# EAGLE design ADS7828-TSSOP (EAGLE 8.1.1)
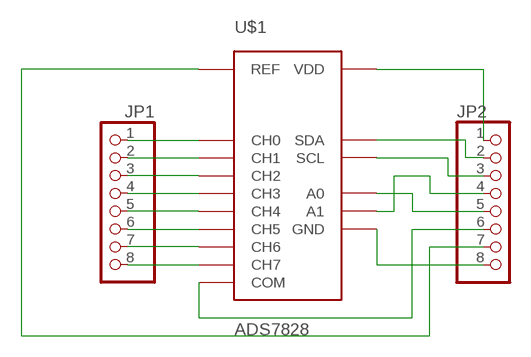
[diagram p0: schematic, sheet 1]

## Parts
JP1  PINHD-1X8  [1X08]
JP2  PINHD-1X8  [1X08]
U$1  ADS7828  [TSSOP16]

## Nets
N$1: JP1.1 U$1.1(CH0)
N$2: JP1.2 U$1.2(CH1)
N$3: JP1.3 U$1.3(CH2)
N$4: JP1.4 U$1.4(CH3)
N$5: JP1.5 U$1.5(CH4)
N$6: JP1.6 U$1.6(CH5)
N$7: JP1.7 U$1.7(CH6)
N$8: JP1.8 U$1.8(CH7)
N$9: JP2.8 U$1.9(GND)
N$10: JP2.7 U$1.10(REF)
N$11: JP2.6 U$1.11(COM)
N$12: JP2.5 U$1.12(A0)
N$13: JP2.4 U$1.13(A1)
N$14: JP2.3 U$1.14(SCL)
N$15: JP2.2 U$1.15(SDA)
N$16: JP2.1 U$1.16(VDD)

## Library data of the parts
JP1 JP2 = pinhead:PINHD-1X8: PIN HEADER
U$1 = texas:ADS7828: Texas Instruments ADS7828 8-channel 12-bit I2C ADC Datasheet <http://www.ti.com/lit/ds/symlink/ads7828.pdf>

## Board
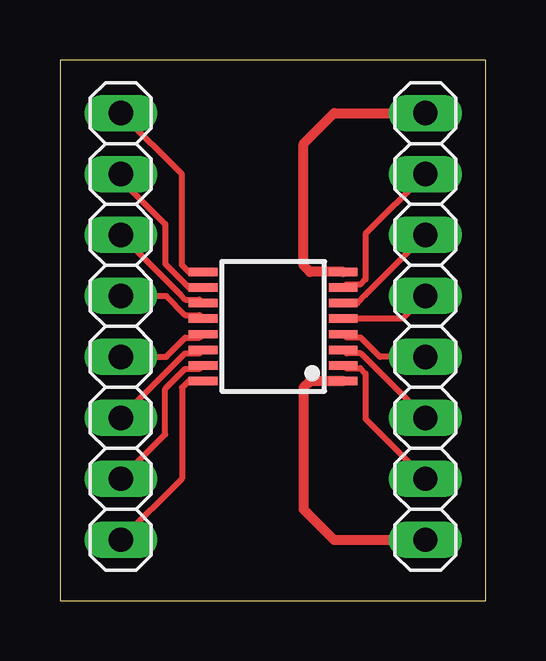
[diagram p1: board, top side]

Size 17.76 x 22.53 mm. Coordinates in mm from the lower left corner, seen from the top.
Outline: 0,0 17.76,0 17.76,22.53 0,22.53 0,0
Copper layers (1*16): Top 0.035mm / dielectric 1.5mm / Bottom 0.035mm
Design rules "default": minimum track width 10mil, minimum drill 24mil, track to track 8mil, track to pad 8mil, pad to pad 8mil, via to via 8mil, smd to smd 8mil, copper to edge 40mil, drill to drill 8mil, minimum pad ring 10mil, minimum via ring 8mil, stop-mask expansion 4mil, vias tented up to drill 0mil, thermal gap 10mil

### Footprints (pad centres in the part's own frame; a part is rotated, then mirrored left to right if it is on the bottom)
1X08 = drill 1.016 long: 1 -8.89,0; 2 -6.35,0; 3 -3.81,0; 4 -1.27,0; 5 1.27,0; 6 3.81,0; 7 6.35,0; 8 8.89,0
TSSOP16 = smd 0.35 x 1.2: 1 -2.275,-2.925; 2 -1.625,-2.925; 3 -0.975,-2.925; 4 -0.325,-2.925; 5 0.325,-2.925; 6 0.975,-2.925; 7 1.625,-2.925; 8 2.275,-2.925; 9 2.275,2.925; 10 1.625,2.925; 11 0.975,2.925; 12 0.325,2.925; 13 -0.325,2.925; 14 -0.975,2.925; 15 -1.625,2.925; 16 -2.275,2.925

### Placement (x,y rotation side)
JP1  15.24,11.43 90 top
JP2  2.54,11.43 90 top
U$1  8.89,11.43 90 top

### Tracks (layer width: path | path; a pad name or v marks a point on that pad's centre or on a via)
N$1
  Top 0.406: U$1.1 10.43,9.15 10.16,8.89 10.16,3.81 11.43,2.54 JP1.1
N$2
  Top 0.254: U$1.2 11.93,9.69 12.52,9.69 12.74,9.47 12.74,7.58 JP1.2
N$3
  Top 0.254: U$1.3 11.96,10.31 12.55,10.31 JP1.3
N$4
  Top 0.254: U$1.4 11.96,10.96 12.55,10.96 13.35,10.16 JP1.4
N$5
  Top 0.254: JP1.5 14.29,11.76 U$1.5
N$6
  Top 0.254: JP1.6 12.74,12.74 12.41,12.4 U$1.6
N$7
  Top 0.254: U$1.7 11.93,13.17 12.52,13.17 12.74,13.39 12.74,15.29 JP1.7
N$8
  Top 0.406: U$1.8 10.43,13.71 10.16,13.97 10.16,19.05 11.43,20.32 JP1.8
N$9
  Top 0.254: U$1.9 5.37,13.71 5.09,13.98 5.09,17.77 JP2.8
N$10
  Top 0.254: JP2.7 2.54,17.55 4.39,15.69 4.39,14.03 5.4,13.02 5.93,13.02 U$1.10
N$11
  Top 0.254: U$1.11 5.82,12.55 5.23,12.55 5.04,12.74 JP2.6
N$12
  Top 0.254: U$1.12 5.82,11.9 5.23,11.9 4.43,12.7 JP2.5
N$13
  Top 0.254: U$1.13 5.82,10.96 5.23,10.96 4.43,10.16 JP2.4
N$14
  Top 0.254: U$1.14 5.82,10.31 5.23,10.31 JP2.3
N$15
  Top 0.254: JP2.2 4.39,6.93 4.39,8.83 5.23,9.66 5.82,9.66 U$1.15
N$16
  Top 0.254: U$1.16 5.37,9.15 5.09,8.88 5.09,5.09 JP2.1